# EAGLE design Triggerboard (EAGLE 9.6.2)
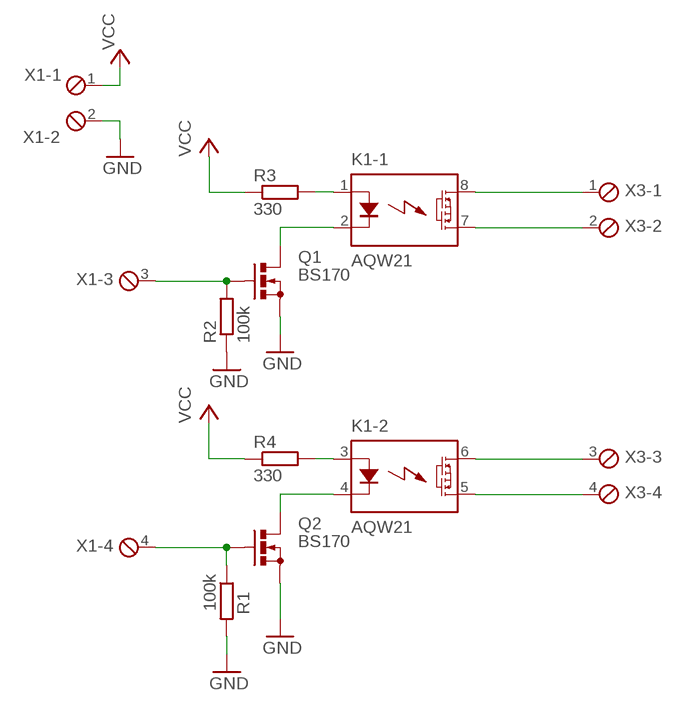
[diagram p0: schematic, sheet 1]

## Parts
K1  AQW21  [DIL08]
Q1  BS170  [SOT54E]
Q2  BS170  [SOT54E]
R1  100k  R-EU_0207/12  [0207/12]
R2  100k  R-EU_0207/12  [0207/12]
R3  330  R-EU_0207/12  [0207/12]
R4  330  R-EU_0207/12  [0207/12]
X1  MPT4  [4POL254]
X3  MPT4  [4POL254]

## Nets
GND: Q1.S Q2.S R1.2 R2.1 X1.2
N$1: K1.1(-1:A) R3.2
N$2: K1.3(-2:A) R4.2
N$3: Q2.G R1.1 X1.4
N$4: K1.8(-1:D1) X3.1
N$5: K1.4(-2:K) Q2.D
N$7: K1.5(-2:D2) X3.4
N$8: K1.6(-2:D1) X3.3
N$9: K1.7(-1:D2) X3.2
N$11: K1.2(-1:K) Q1.D
N$12: Q1.G R2.2 X1.3
VCC: R3.1 R4.1 X1.1

## Library data of the parts
K1 = relay:AQW*: PhotoMOS Relay NAiS Source: http://www.mew-europe.com/.. pti_en.pdf; MF: PANASONIC; MPN: AQW210EH; OC_FARNELL: unknown; OC_NEWARK: 10C3902
Q1 Q2 = transistor-small-signal:BS170: N-CHANNEL MOS FET; MF: ON SEMICONDUCTOR; MPN: BS170; OC_NEWARK: 25M7820
R1 R2 = rcl:R-EU_: RESISTOR, European symbol; OC_NEWARK: unknown; SPICEPREFIX: R
R3 R4 = rcl:R-EU_: RESISTOR, European symbol; MF: MULTICOMP PRO; MPN: MCF 1W 330R; OC_NEWARK: 38K0418; SPICEPREFIX: R
X1 X3 = con-phoenix-254:MPT4: PHOENIX CONNECTOR; OC_FARNELL: unknown; OC_NEWARK: unknown

## Net classes
0 default: width 0.305 mm, drill 0.508 mm, clearance 0.254 mm

## Board
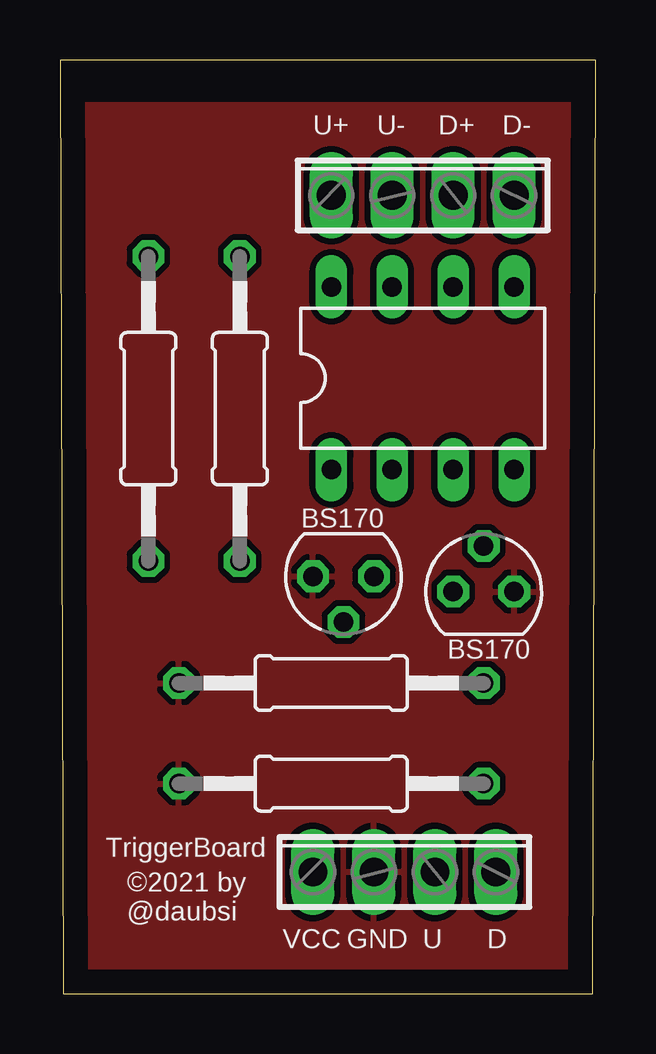
[diagram p1: board, top side]
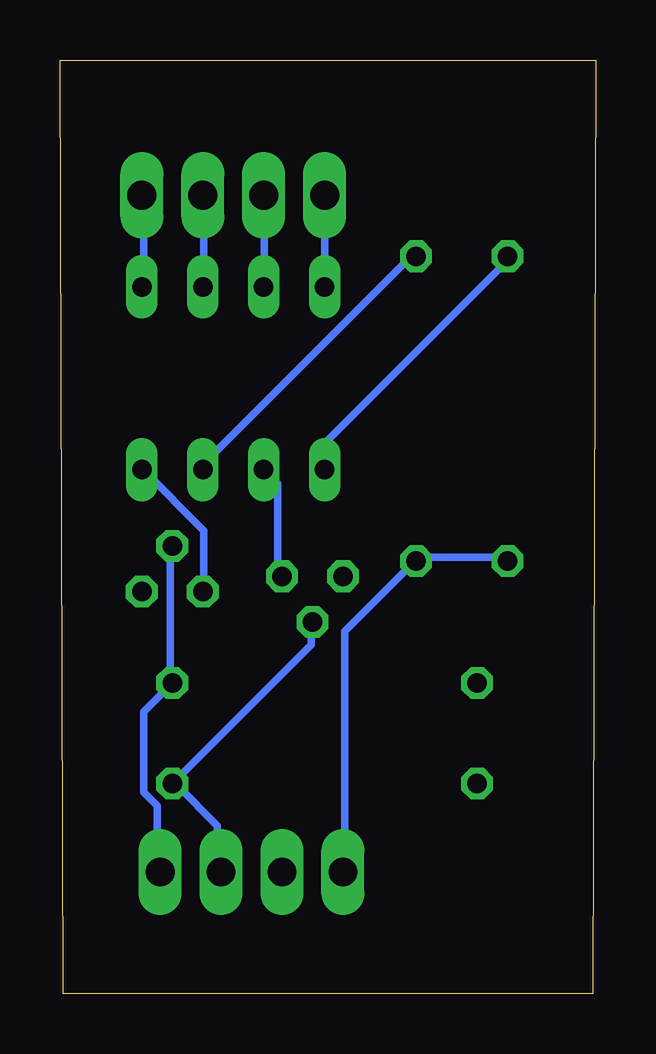
[diagram p2: board, bottom side, seen from below]

Size 22.33 x 38.91 mm. Coordinates in mm from the lower left corner, seen from the top.
Outline: 0.13,0 22.2,0 22.33,38.91 0,38.91 0.13,0
Copper layers (1*16): Top 0.035mm / dielectric 1.5mm / Bottom 0.035mm
Design rules "default": minimum track width 6mil, minimum drill 0.35mm, track to track 6mil, track to pad 6mil, pad to pad 6mil, via to via 6mil, smd to smd 6mil, copper to edge 40mil, drill to drill 6mil, minimum pad ring 10mil, minimum via ring 8mil, stop-mask expansion 4mil, vias tented up to drill 0mil, thermal gap 10mil

### Footprints (pad centres in the part's own frame; a part is rotated, then mirrored left to right if it is on the bottom)
DIL08 = drill 0.813 long: 1 -3.81,-3.81; 2 -1.27,-3.81; 3 1.27,-3.81; 4 3.81,-3.81; 5 3.81,3.81; 6 1.27,3.81; 7 -1.27,3.81; 8 -3.81,3.81
SOT54E = drill 0.813 octagon: D -1.27,0; G 0,1.905; S 1.27,0
0207/12 = drill 0.813 octagon: 1 -6.35,0; 2 6.35,0
4POL254 = drill 1.2 long: 1 -3.81,0; 2 -1.27,0; 3 1.27,0; 4 3.81,0

### Placement (x,y rotation side)
K1  15.11,25.65 0 top
Q1  11.81,17.4 180 top
Q2  17.65,16.76 0 top
R1  11.3,12.95 180 top
R2  11.3,8.76 0 top
R3  3.68,24.38 90 top
R4  7.49,24.38 90 top
X1  14.35,5.08 0 top
X3  15.11,33.27 0 top

### Tracks (layer width: path | path; a pad name or v marks a point on that pad's centre or on a via)
GND
  pour Top: -1.4,37.08 -1.4,-0.13 22.61,-0.13 22.61,37.08
N$1
  Bottom 0.305: K1.1 11.3,22.94 3.76,30.48 R3.2
N$2
  Bottom 0.305: K1.3 16.33,22.1 7.67,30.76 R4.2
N$3
  Bottom 0.305: X1.4 18.29,5.33 18.29,7.85 18.85,8.41 18.85,11.76 R1.1 17.73,13.16 17.73,18.47 Q2.G
N$4
  Bottom 0.305: X3.1 K1.8
N$5
  Bottom 0.305: Q2.D 16.33,16.79 16.33,19.3 18.85,21.82 K1.4
N$7
  Bottom 0.305: K1.5 18.85,29.64 18.85,33.27 X3.4
N$8
  Bottom 0.305: K1.6 16.33,29.64 16.33,33.27 X3.3
N$9
  Bottom 0.305: K1.7 13.82,29.64 13.82,33.27 X3.2
N$11
  Bottom 0.305: K1.2 13.26,21.26 13.26,17.63 Q1.D
N$12
  Bottom 0.305: 15.49,5.33 X1.3 15.77,5.33 15.77,7.01 17.45,8.69 R2.2 11.86,14.55 11.86,15.39 Q1.G
VCC
  Bottom 0.305: R3.1 3.76,18.19 7.39,18.19 R4.1 7.67,17.91 10.46,15.11 10.46,5.33 X1.1

### Text on the board
tNames: U+ | U- | D+ | D- | BS170 | BS170 | TriggerBoard | ©2021 by / @daubsi | VCC | GND | U | D